# Altium project PDB_02.PrjPcb
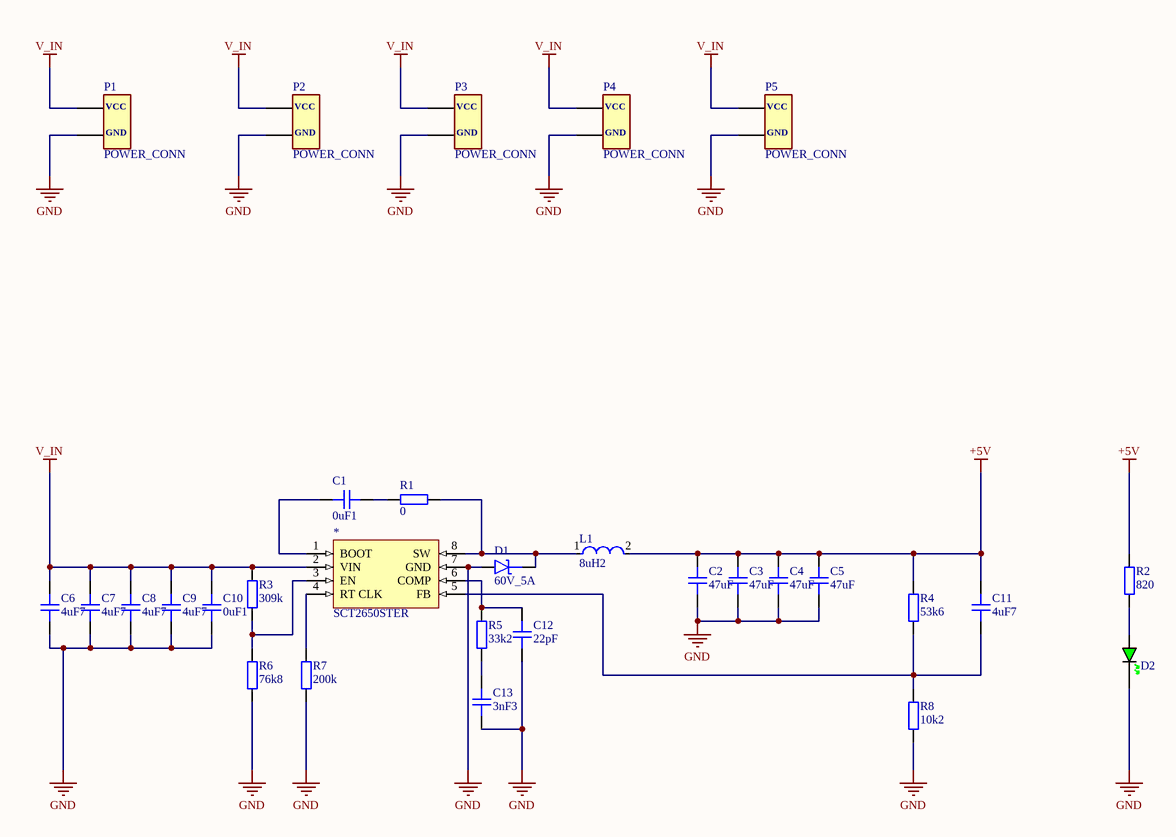
[diagram p0: Sheet1.SchDoc]
1 sheet, 30 parts. Net scope: global (net labels, ports and power ports of the same name join across sheets).
Board file: PCB1.PcbDoc

## Sheet Sheet1.SchDoc
size A4; SheetNumber: 1; SheetTotal: 1

### Parts
*  SCT2650STER  [SCT2650STER]
C1  0uF1  [CAP_0805]
C2  47uF  [CAP_0805]
C3  47uF  [CAP_0805]
C4  47uF  [CAP_0805]
C5  47uF  [CAP_0805]
C6  4uF7  [CAP_0805]
C7  4uF7  [CAP_0805]
C8  4uF7  [CAP_0805]
C9  4uF7  [CAP_0805]
C10  0uF1  [CAP_0805]
C11  4uF7  [CAP_0805]
C12  22pF  [CAP_0805]
C13  3nF3  [CAP_0805]
D1  60V_5A  [DO-214AC-2 (SMA)]
D2  GREEN  [LED_0805_GREEN]  (value not drawn)
L1  8uH2  [FP-CDRH104R-MFG]
P1  POWER_CONN  [POWER_CONN]
P2  POWER_CONN  [POWER_CONN]
P3  POWER_CONN  [POWER_CONN]
P4  POWER_CONN  [POWER_CONN]
P5  POWER_CONN  [POWER_CONN]
R1  0  [RES_0805]
R2  820  [RES_0805]
R3  309k  [RES_0805]
R4  53k6  [RES_0805]
R5  33k2  [RES_0805]
R6  76k8  [RES_0805]
R7  200k  [RES_0805]
R8  10k2  [RES_0805]

### Nets
+5V: C2.2 C3.2 C4.2 C5.2 C11.1 L1.2 R2.2 R4.2
GND: *.7(GND) C2.1 C3.1 C4.1 C5.1 C6.1 C7.1 C8.1 C9.1 C10.1 C12.2 C13.2 D1.A D2.K P1.1(GND) P2.1(GND) P3.1(GND) P4.1(GND) P5.1(GND) R6.1 R7.1 R8.1
V_IN: *.2(VIN) C6.2 C7.2 C8.2 C9.2 C10.2 P1.0(VCC) P2.0(VCC) P3.0(VCC) P4.0(VCC) P5.0(VCC) R3.2
Net*_1: *.1(BOOT) C1.2
Net*_3: *.3(EN) R3.1 R6.2
Net*_4: *.4(RT_CLK) R7.2
Net*_5: *.5(FB) C11.2 R4.1 R8.2
Net*_6: *.6(COMP) C12.1 R5.2
Net*_8: *.8(SW) D1.K L1.1 R1.1
NetC1_1: C1.1 R1.2
NetC13_1: C13.1 R5.1
NetD2_A: D2.A R2.1

### Library data of the parts
C1-C13 = CAP_0805: Capacitor SMD 0805; Manufacturer: *; Manufacturer Part Number: *; Distributor Link: *; LCSC: *; Rating: *; Dielectric: *
D1 = D_SCHOTTKY_SMA: Diode Schottky SMD SMA (DO-214AA)
D2 = LED_0805_GREEN: LED 0805 GREEN SMD; Manufacturer: *; Manufacturer Part Number: *; Distributor Link: *; LCSC: *
L1 = CMP-48855-000006-1: FIXED IND 5.2UH 6A 22 MOHM SMD; Core Material: Ferrite; Max DC Current: 5.4A; Rated Current-Max: 5.5A; Test Frequency: 100kHz; Saturation Current: 5.6A; Tolerance: 30%; DC Resistance (DCR): 22mR; Shielding: Shielded; Depth: 10.3mm; Lead Free: Lead Free; Series: CDRH; Min Operating Temperature: -40°C; Mount: Surface Mount; Max Operating Temperature: 100°C; Termination: SMD/SMT; Width: 0.394inch; Radiation Hardening: No; Package Quantity: 1; Height: 4mm; Height - Seated (Max): 0.157inch; Military Standard: Not; Inductance: 5.2uH; Length: 10.5mm; Packaging: Tape and Reel; DC Current: 5.4A; Case/Package: Nonstandard; Current Rating: 5.4A
P1-P5 = POWER_CONN: Li-on Battery Power Connector
R1-R8 = RES_0805: Resistor SMD 0805; Manufacturer: *; Manufacturer Part Number: *; Distributor Link: *; LCSC: *